# Altium project Phaser.PrjPCB (part 6 of 9)

## Sheet FPGA_GTP.SchDoc: Phaser
size 420 x 297 mm; EDA_Number: ARTIQ; Projet: ARTIQ/SINARA; Author: G.Kasprowicz; CompanyName: WUT ISE; DrawnBy: G.Kasprowicz; Organization: WUT ISE; Address1: PW ISE; Address2: Nowowiejska 15/19 00-665 Warsaw; Address3: gkasprow@gmail.com; DocumentNumber: 13; Revision: 2; SheetNumber: 13; SheetTotal: 18; ModifiedBy: -; CheckedDate: -; Title2: GTP & SATA; DivGrp: WUT ISE; Designer: G.Kasprowicz; ModifiedDate: -; ProjectName: Sensor Box
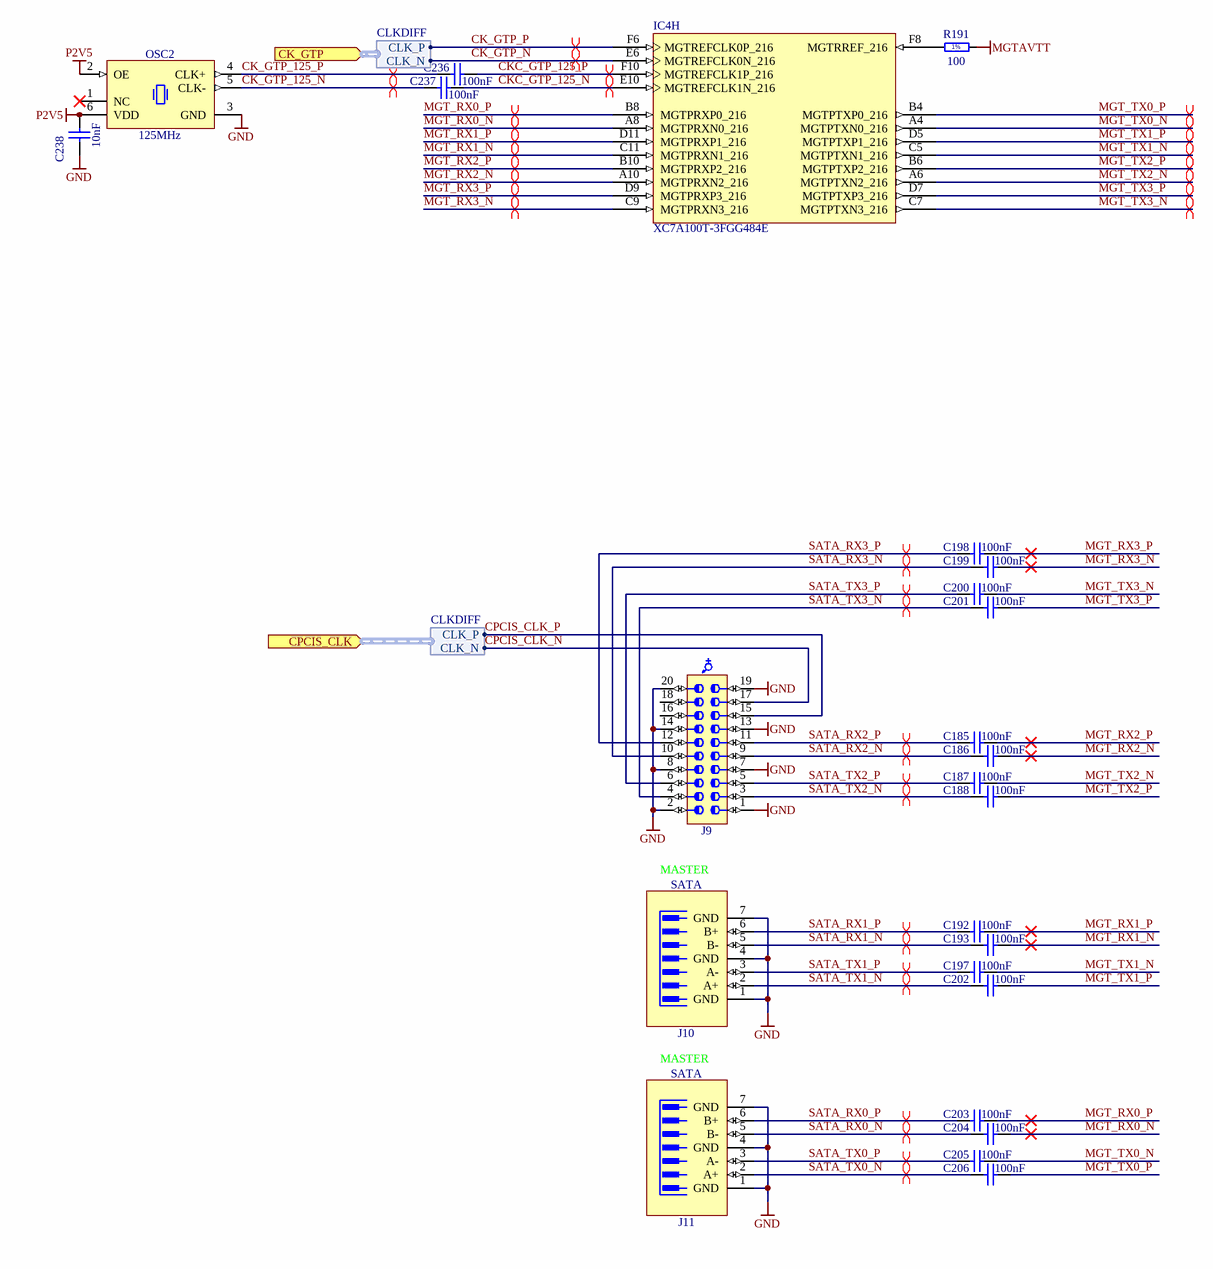
[diagram p10: FPGA_GTP.SchDoc]

### Parts
(Parts that share a designator on the sheet are numbered #1, #2 ... from top to bottom, then left to right.)
C185  100nF  [CAPC0603X33N]
C186  100nF  [CAPC0603X33N]
C187  100nF  [CAPC0603X33N]
C188  100nF  [CAPC0603X33N]
C192  100nF  [CAPC0603X33N]
C193  100nF  [CAPC0603X33N]
C197  100nF  [CAPC0603X33N]
C198  100nF  [CAPC0603X33N]
C199  100nF  [CAPC0603X33N]
C200  100nF  [CAPC0603X33N]
C201  100nF  [CAPC0603X33N]
C202  100nF  [CAPC0603X33N]
C203  100nF  [CAPC0603X33N]
C204  100nF  [CAPC0603X33N]
C205  100nF  [CAPC0603X33N]
C206  100nF  [CAPC0603X33N]
C236  100nF  [CAPC0603X33N]
C237  100nF  [CAPC0603X33N]
C238  10nF  [CAPC1005X55N]
IC4#2  XC7A100T-3FGG484E  [FGG484]  (part H of 10)
J9  (no value)  [SAMTEC_LSS-110-01-L-DV-A]
J10  SATA  [MOLEX_67800-5005]
J11  SATA  [MOLEX_67800-5005]
OSC2  125MHz  [OSC_SILICON-LAB_SI510-6N]
R191  100  [RESC1005X40N]

### Ports
CK_GTP (in, harness CLKDIFF), CPCIS_CLK (in, harness CLKDIFF)

### Harnesses
CLKDIFF: CLK_N, CLK_P

### Nets
GND: C238.1 J9.1 J9.2 J9.7 J9.8 J9.13 J9.14 J9.19 J9.20 J10.1(GND) J10.4(GND) J10.7(GND) J11.1(GND) J11.4(GND) J11.7(GND) OSC2.3(GND)
MGTAVTT: R191.1
P2V5: C238.2 OSC2.2(OE) OSC2.6(VDD)
CK_GTP_125_N: C237.1 OSC2.5(CLK-)
CK_GTP_125_P: C236.1 OSC2.4(CLK+)
CK_GTP_N: IC4#2.E6(MGTREFCLK0N_216) ; port CK_GTP.CLK_N
CK_GTP_P: IC4#2.F6(MGTREFCLK0P_216) ; port CK_GTP.CLK_P
CKC_GTP_125_N: C237.2 IC4#2.E10(MGTREFCLK1N_216)
CKC_GTP_125_P: C236.2 IC4#2.F10(MGTREFCLK1P_216)
CPCIS_CLK_N: J9.17 ; port CPCIS_CLK.CLK_N
CPCIS_CLK_P: J9.15 ; port CPCIS_CLK.CLK_P
MGT_RX0_N: C204.2 IC4#2.A8(MGTPRXN0_216)
MGT_RX0_P: C203.2 IC4#2.B8(MGTPRXP0_216)
MGT_RX1_N: C193.2 IC4#2.C11(MGTPRXN1_216)
MGT_RX1_P: C192.2 IC4#2.D11(MGTPRXP1_216)
MGT_RX2_N: C186.2 IC4#2.A10(MGTPRXN2_216)
MGT_RX2_P: C185.2 IC4#2.B10(MGTPRXP2_216)
MGT_RX3_N: C199.2 IC4#2.C9(MGTPRXN3_216)
MGT_RX3_P: C198.2 IC4#2.D9(MGTPRXP3_216)
MGT_TX0_N: C205.2 IC4#2.A4(MGTPTXN0_216)
MGT_TX0_P: C206.2 IC4#2.B4(MGTPTXP0_216)
MGT_TX1_N: C197.2 IC4#2.C5(MGTPTXN1_216)
MGT_TX1_P: C202.2 IC4#2.D5(MGTPTXP1_216)
MGT_TX2_N: C187.2 IC4#2.A6(MGTPTXN2_216)
MGT_TX2_P: C188.2 IC4#2.B6(MGTPTXP2_216)
MGT_TX3_N: C200.2 IC4#2.C7(MGTPTXN3_216)
MGT_TX3_P: C201.2 IC4#2.D7(MGTPTXP3_216)
SATA_RX0_N: C204.1 J11.5(B-)
SATA_RX0_P: C203.1 J11.6(B+)
SATA_RX1_N: C193.1 J10.5(B-)
SATA_RX1_P: C192.1 J10.6(B+)
SATA_RX2_N: C186.1 J9.9
SATA_RX2_P: C185.1 J9.11
SATA_RX3_N: C199.1 J9.10
SATA_RX3_P: C198.1 J9.12
SATA_TX0_N: C206.1 J11.2(A+)
SATA_TX0_P: C205.1 J11.3(A-)
SATA_TX1_N: C202.1 J10.2(A+)
SATA_TX1_P: C197.1 J10.3(A-)
SATA_TX2_N: C188.1 J9.3
SATA_TX2_P: C187.1 J9.5
SATA_TX3_N: C201.1 J9.4
SATA_TX3_P: C200.1 J9.6
NetIC4#2_F8: IC4#2.F8(MGTRREF_216) R191.2

Not connected (* = marked no-connect by the designer): J9 16 18; OSC2 1(NC)*

### Layout directives
differential pair: CK_GTP_N, CK_GTP_P
differential pair; net class Diff_100Ohm; differential pair class Diff_100Ohm: CK_GTP_125_N, CK_GTP_125_P, CKC_GTP_125_N, CKC_GTP_125_P, MGT_RX0_N, MGT_RX0_P, MGT_RX1_N, MGT_RX1_P, MGT_RX2_N, MGT_RX2_P, MGT_RX3_N, MGT_RX3_P, MGT_TX0_N, MGT_TX0_P, MGT_TX1_N, MGT_TX1_P, MGT_TX2_N, MGT_TX2_P, MGT_TX3_N, MGT_TX3_P, SATA_RX0_N, SATA_RX0_P, SATA_RX1_N, SATA_RX1_P, SATA_RX2_N, SATA_RX2_P, SATA_RX3_N, SATA_RX3_P, SATA_TX0_N, SATA_TX0_P, SATA_TX1_N, SATA_TX1_P, SATA_TX2_N, SATA_TX2_P, SATA_TX3_N, SATA_TX3_P

### Notes on the sheet
- MASTER
- Project/Equipment
- Document
- Designer
- Drawn by
- Check.by
- Copyright WUT ISE 2018.
  This documentation describes Open Hardware and is licensed under the CERN OHL v.1.1. You may redistribute and modify this documentation under the terms of the CERN OHL v.1.1. (http://ohwr.org/CERNOHL). This documentation is distributed WITHOUT ANY EXPRESS OR IMPLIED WARRANTY, INCLUDING OF MERCHANTABILITY, SATISFACTORY QUALITY AND FITNESS FOR A PARTICULAR PURPOSE. Please see the CERN OHL v.1.1 for applicable conditions.
- Contact
- File
- Last Mod.
- Print Date
- Sheet
- Size
- A3
- of
- Rev
- (in symbol R0402_100R_1%_0.0625W_100PPM) 1%

### Library data of the parts
C185-C188 C192 C193 C197-C206 C236 C237 = CC0201_100NF_6.3V_10%_X5R: Non-polarised capacitor; Part Description: SMD Multilayer Chip Ceramic Capacitor; Manufacturer: GENERIC; Manufacturer1 Part Number: 02016D104KAT2A; Voltage: 6.3V; TC: X5R; Tolerance: ±10%; Part Number: CC0201_100NF_6.3V_10%_X5R; Component Kind: Standard; Component Type: Standard; Pin Count: 2; Value: 100nF; Status: Not Recommended; Manufacturer Part Number: CC0201_100NF_6.3V_10%_X5R; Case: 0201; Mounted: Yes; Socket: No; SMD: Yes; Sense: No; Manufacturer1 Example: AVX; Manufacturer1 ComponentHeight: 0.33mm; HelpURL: \\cern.ch\dfs\Applications\Altium\Datasheets\CC0201_X5R_AVX.pdf; Author: CERN DEM JLC; CreateDate: 2007-12-03; LatestRevisionDate: 2007-12-03
  C185-C188 C192 C193 C197-C206: ClassName: SATA
C238 = CC0402_10NF_16V_10%_X7R: Non-polarised capacitor; Part Description: SMD Multilayer Chip Ceramic Capacitor; Manufacturer: GENERIC; Manufacturer1 Part Number: 223878715636; Voltage: 16V; TC: X7R; Tolerance: ±10%; Part Number: CC0402_10NF_16V_10%_X7R; Component Kind: Standard; Component Type: Standard; Pin Count: 2; Value: 10nF; Status: Not Recommended; Manufacturer Part Number: CC0402_10NF_16V_10%_X7R; Case: 0402; Mounted: Yes; Socket: No; SMD: Yes; Sense: No; Manufacturer1 Example: PHYCOMP; Manufacturer1 ComponentHeight: 0.55mm; HelpURL: \\cern.ch\dfs\Applications\Altium\Datasheets\CC0402_X7R_PHYCOMP.pdf; Author: CERN DEM JLC; CreateDate: 03.12.2007; LatestRevisionDate: 03.12.2007
IC4#2 = CMP-0364-00028-3: Artix-7 FPGA, 285 User I/Os, 4 GTP, 484-Ball BGA, Speed Grade 3, Extended Grade, Pb-Free; Manufacturer: Xilinx; Max User I/O: 300; Clock Mgmt Tiles (CMTs): 6; Logic Cells: 101440; Block RAM Blocks (36Kb): 135; Block RAM Blocks (18Kb): 270; Speed Grade: -3; CLBs (Slices): 15850; Block RAM Blocks (Max Kb): 4860; DSP48E1 Slices: 240; RoHS: Pb-Free; ComponentLink3URL: http://www.xilinx.com/support/documentation/data_sheets/ds181_Artix_7_Data_Sheet.pdf; NexusDeviceID: XC7A100T-3FGG484E; DatasheetVersion: v1.12; Mounting Technology: Surface Mount; PackageDescription: Wire-Bond Fine-Pitch BGA, Body 23 x 23 mm, 1.0 mm Pitch; PackageReference: FGG484; ComponentLink2Description: Package Specification; Code_JEDEC: MS-034-AAJ-1; ComponentLink2URL: http://www.xilinx.com/support/documentation/user_guides/ug475_7Series_Pkg_Pinout.pdf; ComponentLink3Description: DC and Switching Characteristics; Generic Part Number: XC7A100T; ComponentLink4Description: Package File; ComponentLink4URL: http://www.xilinx.com/support/packagefiles/a7packages/xc7a100tfgg484pkg.txt; ComponentLink1URL: http://www.xilinx.com/support/documentation/data_sheets/ds180_7Series_Overview.pdf; PartNumber: XC7A100T-3FGG484E; ComponentLink5URL: http://www.xilinx.com/support/documentation/user_guides/ug475_7Series_Pkg_Pinout.pdf; PackageVersion: Rev 1.8; ComponentLink5Description: Packaging and Pinout; ComponentLink1Description: Datasheet; CLBs (Max Distributed RAM Kb): 1188
J9 = SAMTEC_LSS-110-01-L-DV-A: Connector 20 Hermaphroditic; Part Description: 20 Contacts, Pitch 0.635mm, Razor Beam LSS Vertical High Speed Hermaphroditic Strip (Lead Style 4.5mm); Manufacturer: SAMTEC; PressFit: No; Part Number: SAMTEC_LSS-110-01-L-DV-A; Component Kind: Standard; Component Type: Standard; Pin Count: 20; Mounted: Yes; Socket: No; Sense: No; SMD: Yes; Status: None; Manufacturer Part Number: LSS-110-01-L-DV-A; ComponentHeight: 4.57mm; HelpURL: \\cern.ch\dfs\Applications\Altium\Datasheets\SAMTEC_LSS-110-01-L-DV-A.pdf; Author: CERN DEM MR; CreateDate: 07.03.2016; LatestRevisionDate: 07.03.2016
J10 J11 = MOLEX_67800-5005: 7 Pin SATA Receptacle; Part Description: 1.27mm Pitch, 7 Contacts, Serial ATA High Speed Header, Straight with Locking Latch; Manufacturer: MOLEX; PressFit: No; Part Number: MOLEX_67800-5005; Component Kind: Standard; Component Type: Standard; Pin Count: 7; Family: SATA; Mounted: Yes; Socket: No; SMD: Yes; Sense: No; Status: None; Manufacturer Part Number: 67800-5005; ComponentHeight: 8.4mm; HelpURL: \\cern.ch\dfs\Applications\Altium\Datasheets\MOLEX_67800-5005.pdf; Author: CERN DEM MR; CreateDate: 01.12.2016; LatestRevisionDate: 01.12.2016; ClassName: SATA
OSC2 = OSC_125MHZ_SILICON-LAB_510FBA125M000AAG: Crystal Oscillator 6 pins, Si510 (LVDS/LVPECL/HCSL/Dual CMOS); Part Description: 2.5V ±25ppm LVDS Crystal Oscillator (XO), Si510 Series; Manufacturer: SILICON LABS; PressFit: No; Bonding: No; Part Number: OSC_125MHZ_SILICON-LAB_510FBA125M000AAG; Component Kind: Standard; Component Type: Standard; PackageDescription: Oscillator Si510 Series, 6 pins, 5x7mm; Value: 125MHz; Manufacturer Part Number: 510FBA125M000AAG; Pin Count: 6; Mounted: Yes; Socket: No; SMD: Yes; Sense: No; ComponentHeight: 1.8mm; HelpURL: \\cern.ch\dfs\Applications\Altium\Datasheets\OSC_SILICON-LAB_SI510.pdf; Author: CERN DEM JMW; CreateDate: 2015-08-10; LatestRevisionDate: 2015-08-10
R191 = R0402_100R_1%_0.0625W_100PPM: Resistor - 1%; Part Description: General Purpose Thick Film Chip Resistor; Manufacturer: GENERIC; Manufacturer1 Part Number: 232270671001L; TC: ±100ppm/°C; PressFit: No; Part Number: R0402_100R_1%_0.0625W_100PPM; Component Kind: Standard; Component Type: Standard; Pin Count: 2; Value: 100; Status: Not Recommended; Power: 0.0625W; Tolerance: ±1%; Manufacturer Part Number: R0402_100R_1%_0.0625W_100PPM; Case: 0402; Mounted: Yes; Sense: No; Socket: No; SMD: Yes; Manufacturer1 Example: YAGEO PHYCOMP; Manufacturer1 ComponentHeight: 0.4mm; HelpURL: \\cern.ch\dfs\Applications\Altium\Datasheets\R0402_Phycomp_RC0402.pdf; Author: CERN DEM JLC; CreateDate: 03.12.2007; LatestRevisionDate: 17.10.2012; ClassName: Artix

## Sheet FPGA_SDRAM.SchDoc: Phaser
size 420 x 297 mm; EDA_Number: ARTIQ; Projet: ARTIQ/SINARA; Author: G.Kasprowicz; CompanyName: WUT ISE; DrawnBy: G.Kasprowicz; Organization: WUT ISE; Address1: PW ISE; Address2: Nowowiejska 15/19 00-665 Warsaw; Address3: gkasprow@gmail.com; DocumentNumber: 14; Revision: 2; SheetNumber: 14; SheetTotal: 18; ModifiedBy: -; CheckedDate: -; Title2: FPGA SDRAM; DivGrp: WUT ISE; Designer: G.Kasprowicz; ModifiedDate: -; ProjectName: Sensor Box
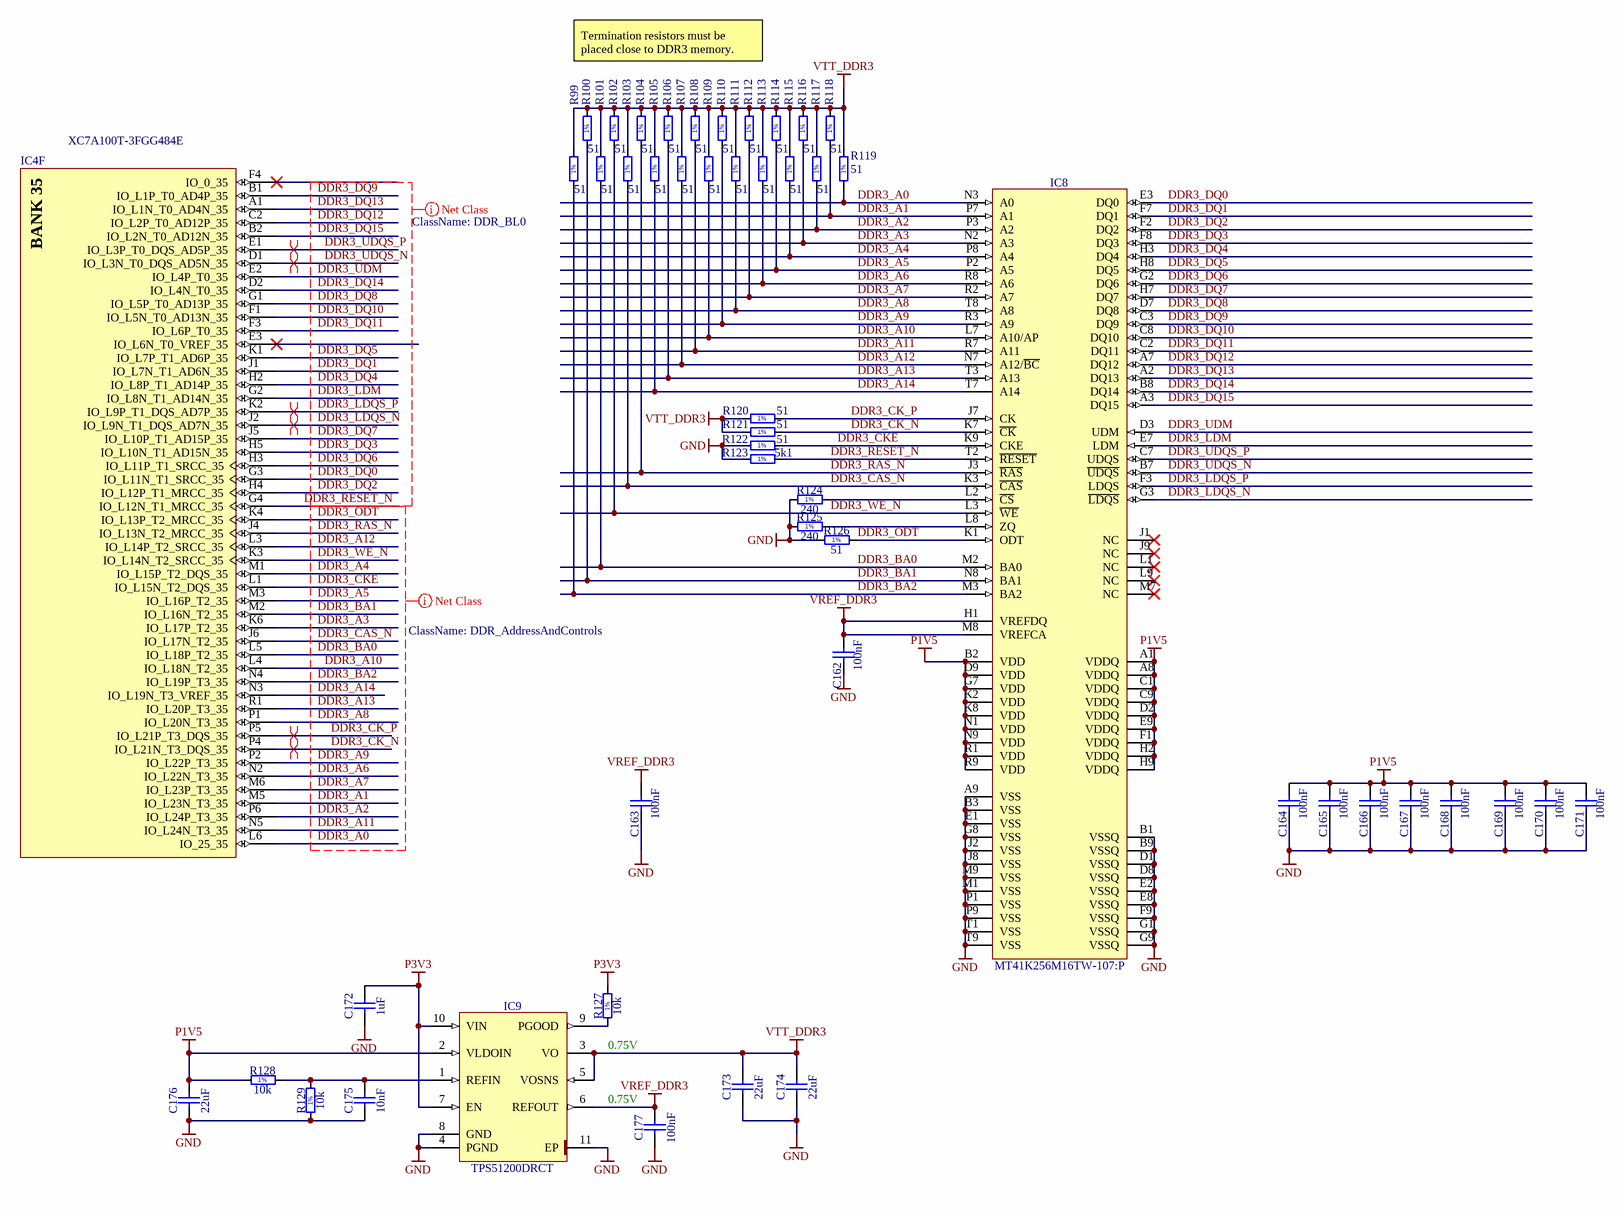
[diagram p11: FPGA_SDRAM.SchDoc]

### Parts
(Parts that share a designator on the sheet are numbered #1, #2 ... from top to bottom, then left to right.)
C162  100nF  [CAPC0603X33N]
C163  100nF  [CAPC0603X33N]
C164  100nF  [CAPC0603X33N]
C165  100nF  [CAPC0603X33N]
C166  100nF  [CAPC0603X33N]
C167  100nF  [CAPC0603X33N]
C168  100nF  [CAPC0603X33N]
C169  100nF  [CAPC0603X33N]
C170  100nF  [CAPC0603X33N]
C171  100nF  [CAPC0603X33N]
C172  1uF  [CAPC1005X55N]
C173  22uF  [CAPC1709X100N]
C174  22uF  [CAPC1709X100N]
C175  10nF  [CAPC1005X55N]
C176  22uF  [CAPC1709X100N]
C177  100nF  [CAPC0603X33N]
IC4#1  XC7A100T-3FGG484E  [FGG484]  (part F of 10)
IC8  MT41K256M16TW-107:P  [BGA96C80P9X16_800X1400X120]
IC9  TPS51200DRCT  [TEXAS_DRC (S-PVSON-N10)]
R99  51  [RESC1005X40N]
R100  51  [RESC1005X40N]
R101  51  [RESC1005X40N]
R102  51  [RESC1005X40N]
R103  51  [RESC1005X40N]
R104  51  [RESC1005X40N]
R105  51  [RESC1005X40N]
R106  51  [RESC1005X40N]
R107  51  [RESC1005X40N]
R108  51  [RESC1005X40N]
R109  51  [RESC1005X40N]
R110  51  [RESC1005X40N]
R111  51  [RESC1005X40N]
R112  51  [RESC1005X40N]
R113  51  [RESC1005X40N]
R114  51  [RESC1005X40N]
R115  51  [RESC1005X40N]
R116  51  [RESC1005X40N]
R117  51  [RESC1005X40N]
R118  51  [RESC1005X40N]
R119  51  [RESC1005X40N]
R120  51  [RESC1005X40N]
R121  51  [RESC1005X40N]
R122  51  [RESC1005X40N]
R123  5k1  [RESC1005X40N]
R124  240  [RESC1005X40N]
R125  240  [RESC1005X40N]
R126  51  [RESC1005X40N]
R127  10k  [RESC1005X40N]
R128  10k  [RESC1005X40N]
R129  10k  [RESC1005X40N]

### Nets
GND: C162.1 C163.1 C164.1 C165.1 C166.1 C167.1 C168.1 C169.1 C170.1 C171.1 C172.1 C173.1 C174.1 C175.1 C176.1 C177.1 IC8.A9(VSS) IC8.B1(VSSQ) IC8.B3(VSS) IC8.B9(VSSQ) IC8.D1(VSSQ) IC8.D8(VSSQ) IC8.E1(VSS) IC8.E2(VSSQ) IC8.E8(VSSQ) IC8.F9(VSSQ) IC8.G1(VSSQ) IC8.G8(VSS) IC8.G9(VSSQ) IC8.J2(VSS) IC8.J8(VSS) IC8.M1(VSS) IC8.M9(VSS) IC8.P1(VSS) IC8.P9(VSS) IC8.T1(VSS) IC8.T9(VSS) IC9.4(PGND) IC9.8(GND) IC9.11(EP) R122.1 R123.1 R124.1 R125.1 R126.1 R129.1
P1V5: C164.2 C165.2 C166.2 C167.2 C168.2 C169.2 C170.2 C171.2 C176.2 IC8.A1(VDDQ) IC8.A8(VDDQ) IC8.B2(VDD) IC8.C1(VDDQ) IC8.C9(VDDQ) IC8.D2(VDDQ) IC8.D9(VDD) IC8.E9(VDDQ) IC8.F1(VDDQ) IC8.G7(VDD) IC8.H2(VDDQ) IC8.H9(VDDQ) IC8.K2(VDD) IC8.K8(VDD) IC8.N1(VDD) IC8.N9(VDD) IC8.R1(VDD) IC8.R9(VDD) IC9.2(VLDOIN) R128.1
P3V3: C172.2 IC9.7(EN) IC9.10(VIN) R127.2
VREF_DDR3: C162.2 C163.2 C177.2 IC8.H1(VREFDQ) IC8.M8(VREFCA) IC9.6(REFOUT)
VTT_DDR3: C173.2 C174.2 IC9.3(VO) IC9.5(VOSNS) R99.2 R100.2 R101.2 R102.2 R103.2 R104.2 R105.2 R106.2 R107.2 R108.2 R109.2 R110.2 R111.2 R112.2 R113.2 R114.2 R115.2 R116.2 R117.2 R118.2 R119.2 R120.1 R121.1
DDR3_A0: IC4#1.L6(IO_25_35) IC8.N3(A0) R119.1
DDR3_A1: IC4#1.M5(IO_L23N_T3_35) IC8.P7(A1) R118.1
DDR3_A2: IC4#1.P6(IO_L24P_T3_35) IC8.P3(A2) R117.1
DDR3_A3: IC4#1.K6(IO_L17P_T2_35) IC8.N2(A3) R116.1
DDR3_A4: IC4#1.M1(IO_L15P_T2_DQS_35) IC8.P8(A4) R115.1
DDR3_A5: IC4#1.M3(IO_L16P_T2_35) IC8.P2(A5) R114.1
DDR3_A6: IC4#1.N2(IO_L22N_T3_35) IC8.R8(A6) R113.1
DDR3_A7: IC4#1.M6(IO_L23P_T3_35) IC8.R2(A7) R112.1
DDR3_A8: IC4#1.P1(IO_L20N_T3_35) IC8.T8(A8) R111.1
DDR3_A9: IC4#1.P2(IO_L22P_T3_35) IC8.R3(A9) R110.1
DDR3_A10: IC4#1.L4(IO_L18N_T2_35) IC8.L7(A10/AP) R109.1
DDR3_A11: IC4#1.N5(IO_L24N_T3_35) IC8.R7(A11) R108.1
DDR3_A12: IC4#1.L3(IO_L14P_T2_SRCC_35) IC8.N7(A12/~{BC}) R107.1
DDR3_A13: IC4#1.R1(IO_L20P_T3_35) IC8.T3(A13) R106.1
DDR3_A14: IC4#1.N3(IO_L19N_T3_VREF_35) IC8.T7(A14) R105.1
DDR3_BA0: IC4#1.L5(IO_L18P_T2_35) IC8.M2(BA0) R101.1
DDR3_BA1: IC4#1.M2(IO_L16N_T2_35) IC8.N8(BA1) R100.1
DDR3_BA2: IC4#1.N4(IO_L19P_T3_35) IC8.M3(BA2) R99.1
DDR3_CAS_N: IC4#1.J6(IO_L17N_T2_35) IC8.K3(~{CAS}) R103.1
DDR3_CK_N: IC4#1.P4(IO_L21N_T3_DQS_35) IC8.K7(~{CK}) R121.2
DDR3_CK_P: IC4#1.P5(IO_L21P_T3_DQS_35) IC8.J7(CK) R120.2
DDR3_CKE: IC4#1.L1(IO_L15N_T2_DQS_35) IC8.K9(CKE) R122.2
DDR3_DQ0: IC4#1.G3(IO_L11N_T1_SRCC_35) IC8.E3(DQ0)
DDR3_DQ1: IC4#1.J1(IO_L7N_T1_AD6N_35) IC8.F7(DQ1)
DDR3_DQ2: IC4#1.H4(IO_L12P_T1_MRCC_35) IC8.F2(DQ2)
DDR3_DQ3: IC4#1.H5(IO_L10N_T1_AD15N_35) IC8.F8(DQ3)
DDR3_DQ4: IC4#1.H2(IO_L8P_T1_AD14P_35) IC8.H3(DQ4)
DDR3_DQ5: IC4#1.K1(IO_L7P_T1_AD6P_35) IC8.H8(DQ5)
DDR3_DQ6: IC4#1.H3(IO_L11P_T1_SRCC_35) IC8.G2(DQ6)
DDR3_DQ7: IC4#1.J5(IO_L10P_T1_AD15P_35) IC8.H7(DQ7)
DDR3_DQ8: IC4#1.G1(IO_L5P_T0_AD13P_35) IC8.D7(DQ8)
DDR3_DQ9: IC4#1.B1(IO_L1P_T0_AD4P_35) IC8.C3(DQ9)
DDR3_DQ10: IC4#1.F1(IO_L5N_T0_AD13N_35) IC8.C8(DQ10)
DDR3_DQ11: IC4#1.F3(IO_L6P_T0_35) IC8.C2(DQ11)
DDR3_DQ12: IC4#1.C2(IO_L2P_T0_AD12P_35) IC8.A7(DQ12)
DDR3_DQ13: IC4#1.A1(IO_L1N_T0_AD4N_35) IC8.A2(DQ13)
DDR3_DQ14: IC4#1.D2(IO_L4N_T0_35) IC8.B8(DQ14)
DDR3_DQ15: IC4#1.B2(IO_L2N_T0_AD12N_35) IC8.A3(DQ15)
DDR3_LDM: IC4#1.G2(IO_L8N_T1_AD14N_35) IC8.E7(LDM)
DDR3_LDQS_N: IC4#1.J2(IO_L9N_T1_DQS_AD7N_35) IC8.G3(~{LDQS})
DDR3_LDQS_P: IC4#1.K2(IO_L9P_T1_DQS_AD7P_35) IC8.F3(LDQS)
DDR3_ODT: IC4#1.K4(IO_L13P_T2_MRCC_35) IC8.K1(ODT) R126.2
DDR3_RAS_N: IC4#1.J4(IO_L13N_T2_MRCC_35) IC8.J3(~{RAS}) R104.1
DDR3_RESET_N: IC4#1.G4(IO_L12N_T1_MRCC_35) IC8.T2(~{RESET}) R123.2
DDR3_UDM: IC4#1.E2(IO_L4P_T0_35) IC8.D3(UDM)
DDR3_UDQS_N: IC4#1.D1(IO_L3N_T0_DQS_AD5N_35) IC8.B7(~{UDQS})
DDR3_UDQS_P: IC4#1.E1(IO_L3P_T0_DQS_AD5P_35) IC8.C7(UDQS)
DDR3_WE_N: IC4#1.K3(IO_L14N_T2_SRCC_35) IC8.L3(~{WE}) R102.1
NetC175_2: C175.2 IC9.1(REFIN) R128.2 R129.2
NetIC8_L2: IC8.L2(~{CS}) R124.2
NetIC8_L8: IC8.L8(ZQ) R125.2
NetIC9_9: IC9.9(PGOOD) R127.1

Not connected (* = marked no-connect by the designer): IC4#1 E3(IO_L6N_T0_VREF_35)* F4(IO_0_35)*; IC8 J1(NC)* J9(NC)* L1(NC)* L9(NC)* M7(NC)*

### Layout directives
differential pair: DDR3_CK_N, DDR3_CK_P, DDR3_LDQS_N, DDR3_LDQS_P, DDR3_UDQS_N, DDR3_UDQS_P
net class DDR_AddressAndControls; net class 50Ohm: DDR3_A0, DDR3_A1, DDR3_A2, DDR3_A3, DDR3_A4, DDR3_A5, DDR3_A6, DDR3_A7, DDR3_A8, DDR3_A9, DDR3_A10, DDR3_A11, DDR3_A12, DDR3_A13, DDR3_A14, DDR3_BA0, DDR3_BA1, DDR3_BA2, DDR3_CAS_N, DDR3_CK_N, DDR3_CK_P, DDR3_CKE, DDR3_ODT, DDR3_RAS_N, DDR3_WE_N
net class DDR_BL0; net class 50Ohm: DDR3_DQ0, DDR3_DQ1, DDR3_DQ2, DDR3_DQ3, DDR3_DQ4, DDR3_DQ5, DDR3_DQ6, DDR3_DQ7, DDR3_DQ8, DDR3_DQ9, DDR3_DQ10, DDR3_DQ11, DDR3_DQ12, DDR3_DQ13, DDR3_DQ14, DDR3_DQ15, DDR3_LDM, DDR3_LDQS_N, DDR3_LDQS_P, DDR3_UDM, DDR3_UDQS_N, DDR3_UDQS_P

### Notes on the sheet
- Termination resistors must be placed close to DDR3 memory.
- (near R127) 0.75V
- (near C177) 0.75V
- Project/Equipment
- Document
- Designer
- Drawn by
- Check.by
- Copyright WUT ISE 2018.
  This documentation describes Open Hardware and is licensed under the CERN OHL v.1.1. You may redistribute and modify this documentation under the terms of the CERN OHL v.1.1. (http://ohwr.org/CERNOHL). This documentation is distributed WITHOUT ANY EXPRESS OR IMPLIED WARRANTY, INCLUDING OF MERCHANTABILITY, SATISFACTORY QUALITY AND FITNESS FOR A PARTICULAR PURPOSE. Please see the CERN OHL v.1.1 for applicable conditions.
- Contact
- File
- Last Mod.
- Print Date
- Sheet
- Size
- A3
- of
- Rev
- (in symbol CMP-0364-00028-3, part F) BANK 35
- (in symbol R0402_5K1_1%_0.0625W_100PPM) 1%
- (in symbol R0402_10K_1%_0.0625W_100PPM) 1%
- (in symbol R0402_51R_1%_0.0625W_100PPM) 1%
- (in symbol R0402_240R_1%_0.0625W_100PPM) 1%

### Library data of the parts
C162-C171 C177 = CC0201_100NF_6.3V_10%_X5R: as C185-C188 on sheet FPGA_GTP; Part Number: CC0201_100NF_6.3V_10%_X5R; Component Kind: Standard; Component Type: Standard; Pin Count: 2; Value: 100nF; Status: Not Recommended; Manufacturer Part Number: CC0201_100NF_6.3V_10%_X5R; Case: 0201; Mounted: Yes; Socket: No; SMD: Yes; Sense: No; Manufacturer1 Example: AVX; Manufacturer1 ComponentHeight: 0.33mm; HelpURL: \\cern.ch\dfs\Applications\Altium\Datasheets\CC0201_X5R_AVX.pdf; Author: CERN DEM JLC
  C162-C171: CreateDate: 2007-12-03; LatestRevisionDate: 2007-12-03
  C177: CreateDate: 03.12.2007; LatestRevisionDate: 03.12.2007
C172 = CC0402_1UF_16V_10%_X5R: Non-polarised capacitor; Part Description: SMD Multilayer Chip Ceramic Capacitor; Manufacturer: GENERIC; Manufacturer1 Part Number: C1005X5R1C105KT; Voltage: 16V; TC: X5R; Tolerance: ±10%; Part Number: CC0402_1UF_16V_10%_X5R; Component Kind: Standard; Component Type: Standard; Pin Count: 2; Value: 1uF; Status: Preferred; Manufacturer Part Number: CC0402_1UF_16V_10%_X5R; Case: 0402; Mounted: Yes; Socket: No; SMD: Yes; Manufacturer1 Example: TDK; Manufacturer1 ComponentHeight: 0.55mm; HelpURL: \\cern.ch\dfs\Applications\Altium\Datasheets\CC0402_X5R_TDK_C.pdf; Author: CERN DEM JLC; CreateDate: 25.10.2012; LatestRevisionDate: 25.10.2012; Sense: No
C173 C174 C176 = CC0603_22UF_6.3V_20%_X5R: Non-polarised capacitor; Part Description: SMD Multilayer Chip Ceramic Capacitor; Manufacturer: GENERIC; Manufacturer1 Part Number: C1608X5R0J226M080AC; Voltage: 6.3V; TC: X5R; Tolerance: ±20%; Part Number: CC0603_22UF_6.3V_20%_X5R; Component Kind: Standard; Component Type: Standard; Pin Count: 2; Value: 22uF; Status: None; Manufacturer Part Number: CC0603_22UF_6.3V_20%_X5R; Case: 0603; Mounted: Yes; Socket: No; SMD: Yes; Manufacturer1 Example: TDK; Manufacturer1 ComponentHeight: 1mm; HelpURL: \\cern.ch\dfs\Applications\Altium\Datasheets\CC0603_X5R_TDK_C.pdf; Author: CERN DEM JLC; CreateDate: 16.12.2013; LatestRevisionDate: 13.09.2016; Sense: No
C175 = CC0402_10NF_16V_10%_X7R: as C238 on sheet FPGA_GTP; Part Number: CC0402_10NF_16V_10%_X7R; Component Kind: Standard; Component Type: Standard; Pin Count: 2; Value: 10nF; Status: Not Recommended; Manufacturer Part Number: CC0402_10NF_16V_10%_X7R; Case: 0402; Mounted: Yes; Socket: No; SMD: Yes; Manufacturer1 Example: PHYCOMP; Manufacturer1 ComponentHeight: 0.55mm; HelpURL: \\cern.ch\dfs\Applications\Altium\Datasheets\CC0402_X7R_PHYCOMP.pdf; Author: CERN DEM JLC; CreateDate: 03.12.2007; LatestRevisionDate: 03.12.2007; Sense: No
IC4#1 = CMP-0364-00028-3: as IC4#2 on sheet FPGA_GTP; RoHS: Pb-Free; ComponentLink3URL: http://www.xilinx.com/support/documentation/data_sheets/ds181_Artix_7_Data_Sheet.pdf; NexusDeviceID: XC7A100T-3FGG484E; DatasheetVersion: v1.12; Mounting Technology: Surface Mount; PackageDescription: Wire-Bond Fine-Pitch BGA, Body 23 x 23 mm, 1.0 mm Pitch; PackageReference: FGG484; ComponentLink2Description: Package Specification; Code_JEDEC: MS-034-AAJ-1; ComponentLink2URL: http://www.xilinx.com/support/documentation/user_guides/ug475_7Series_Pkg_Pinout.pdf; ComponentLink3Description: DC and Switching Characteristics; Generic Part Number: XC7A100T; ComponentLink4Description: Package File; ComponentLink4URL: http://www.xilinx.com/support/packagefiles/a7packages/xc7a100tfgg484pkg.txt; ComponentLink1URL: http://www.xilinx.com/support/documentation/data_sheets/ds180_7Series_Overview.pdf; PartNumber: XC7A100T-3FGG484E; ComponentLink5URL: http://www.xilinx.com/support/documentation/user_guides/ug475_7Series_Pkg_Pinout.pdf; PackageVersion: Rev 1.8; ComponentLink5Description: Packaging and Pinout; ComponentLink1Description: Datasheet; CLBs (Max Distributed RAM Kb): 1188
IC8 = MT41K256M16TW-107:P: 32 Meg x 16 x 8 Banks DDR3L SDRAM; Part Description: +1.5V, 4Gb (32Meg x 16 x 8 banks) DDR3L SDRAM; Manufacturer: MICRON TECHNOLOGY; PressFit: No; Bonding: No; Part Number: MT41K256M16TW-107:P; Component Kind: Standard; Component Type: Standard; Device: MT41K256M16TW-107:P; PackageDescription: BGA 0.8mm, Pitch, Square 96 Pin, 9 Columns x 16 Rows, Body 14mm X 8mm X 1.2mm H; Manufacturer Part Number: MT41K256M16TW-107:P; Pin Count: 96; Case: BGA96; Mounted: Yes; Socket: No; SMD: Yes; Sense: No; ComponentHeight: 1.2mm; HelpURL: \\cern.ch\dfs\Applications\Altium\Datasheets\MT41K256M16TW-107-P.pdf; Author: CERN DEM MR; CreateDate: 2015-12-14; LatestRevisionDate: 2015-12-14
IC9 = TPS51200DRCT: Sink/Source DDR Termination Regulator; Part Description: 3.3V Sink/Source DDR Termination Regulator; Manufacturer: TEXAS INSTRUMENTS; PressFit: No; Bonding: No; Part Number: TPS51200DRCT; Component Kind: Standard; Component Type: Standard; Device: TPS51200DRCT; PackageDescription: SON, 0.50mm Pitch, 10-pin, 3.00mm W  X 3.00mm L X 1.00mm Height, (w/thermal tab 1.75 X 2.50 mm); Manufacturer Part Number: TPS51200DRCT; Pin Count: 11; Case: SON10; Mounted: Yes; Socket: No; SMD: Yes; Sense: No; ComponentHeight: 1mm; HelpURL: \\cern.ch\dfs\Applications\Altium\Datasheets\TPS51200DRCT.pdf; Author: CERN DEM JLC; CreateDate: 03.02.2010; LatestRevisionDate: 06.11.2013
R99-R121 = R0402_51R_1%_0.0625W_100PPM: Resistor - 1%; Part Description: General Purpose Thick Film Chip Resistor; Manufacturer: GENERIC; Manufacturer1 Part Number: 232270675109; TC: ±100ppm/°C; Table: Resistors SMD; Part Number: R0402_51R_1%_0.0625W_100PPM; Component Kind: Standard; Component Type: Standard; Pin Count: 2; Value: 51; Status: Not recommended; Power: 0.0625W; Tolerance: ±1%; Manufacturer Part Number: R0402_51R_1%_0.0625W_100PPM; Mounted: Yes; Socket: No; SMD: Yes; Manufacturer1 Example: PHYCOMP; Manufacturer1 ComponentHeight: 0.4mm; HelpURL: \\cern.ch\dfs\Applications\Altium\Datasheets\R0402_Phycomp_RC0402.pdf; Author: CERN DEM JLC; CreateDate: 03/12/2007; LatestRevisionDate: 13/03/2008
  R99-R118 R120 R121: Case: 0402
R122 R126 = R0402_51R_1%_0.0625W_100PPM: Resistor - 1%; Part Description: General Purpose Thick Film Chip Resistor; Manufacturer: GENERIC; Manufacturer1 Part Number: 232270675109L; TC: ±100ppm/°C; PressFit: No; Part Number: R0402_51R_1%_0.0625W_100PPM; Component Kind: Standard; Component Type: Standard; Pin Count: 2; Value: 51; Status: Not Recommended; Power: 0.0625W; Tolerance: ±1%; Manufacturer Part Number: R0402_51R_1%_0.0625W_100PPM; Case: 0402; Mounted: Yes; Sense: No; Socket: No; SMD: Yes; Manufacturer1 Example: YAGEO PHYCOMP; Manufacturer1 ComponentHeight: 0.4mm; HelpURL: \\cern.ch\dfs\Applications\Altium\Datasheets\R0402_Phycomp_RC0402.pdf; Author: CERN DEM JLC; CreateDate: 2007-12-03; LatestRevisionDate: 2012-10-17
R123 = R0402_5K1_1%_0.0625W_100PPM: Resistor - 1%; Part Description: General Purpose Thick Film Chip Resistor; Manufacturer: GENERIC; Manufacturer1 Part Number: 232270675102L; TC: ±100ppm/°C; PressFit: No; Part Number: R0402_5K1_1%_0.0625W_100PPM; Component Kind: Standard; Component Type: Standard; Pin Count: 2; Value: 5k1; Status: Not Recommended; Power: 0.0625W; Tolerance: ±1%; Manufacturer Part Number: R0402_5K1_1%_0.0625W_100PPM; Case: 0402; Mounted: Yes; Sense: No; Socket: No; SMD: Yes; Manufacturer1 Example: YAGEO PHYCOMP; Manufacturer1 ComponentHeight: 0.4mm; HelpURL: \\cern.ch\dfs\Applications\Altium\Datasheets\R0402_Phycomp_RC0402.pdf; Author: CERN DEM JLC; CreateDate: 03.12.2007; LatestRevisionDate: 17.10.2012
R124 R125 = R0402_240R_1%_0.0625W_100PPM: Resistor - 1%; Part Description: General Purpose Thick Film Chip Resistor; Manufacturer: GENERIC; Manufacturer1 Part Number: 232270672401L; TC: ±100ppm/°C; PressFit: No; Part Number: R0402_240R_1%_0.0625W_100PPM; Component Kind: Standard; Component Type: Standard; Pin Count: 2; Value: 240; Status: Not Recommended; Power: 0.0625W; Tolerance: ±1%; Manufacturer Part Number: R0402_240R_1%_0.0625W_100PPM; Case: 0402; Mounted: Yes; Sense: No; Socket: No; SMD: Yes; Manufacturer1 Example: YAGEO PHYCOMP; Manufacturer1 ComponentHeight: 0.4mm; HelpURL: \\cern.ch\dfs\Applications\Altium\Datasheets\R0402_Phycomp_RC0402.pdf; Author: CERN DEM JLC; CreateDate: 03.12.2007; LatestRevisionDate: 17.10.2012
R127-R129 = R0402_10K_1%_0.0625W_100PPM: Resistor - 1%; Part Description: General Purpose Thick Film Chip Resistor; Manufacturer: GENERIC; Manufacturer1 Part Number: 232270671003L; TC: ±100ppm/°C; PressFit: No; Part Number: R0402_10K_1%_0.0625W_100PPM; Component Kind: Standard; Component Type: Standard; Pin Count: 2; Value: 10k; Status: Not Recommended; Power: 0.0625W; Tolerance: ±1%; Manufacturer Part Number: R0402_10K_1%_0.0625W_100PPM; Case: 0402; Mounted: Yes; Socket: No; SMD: Yes; Manufacturer1 Example: YAGEO PHYCOMP; Manufacturer1 ComponentHeight: 0.4mm; HelpURL: \\cern.ch\dfs\Applications\Altium\Datasheets\R0402_Phycomp_RC0402.pdf; Author: CERN DEM JLC; CreateDate: 03.12.2007; LatestRevisionDate: 17.10.2012; Sense: No

## Sheet FPGA_ADC_DAC.SchDoc: Phaser
size 420 x 297 mm; EDA_Number: ARTIQ; Projet: ARTIQ/SINARA; Author: G.Kasprowicz; CompanyName: WUT ISE; DrawnBy: G.Kasprowicz; Organization: WUT ISE; Address1: PW ISE; Address2: Nowowiejska 15/19 00-665 Warsaw; Address3: gkasprow@gmail.com; DocumentNumber: 8; Revision: 2; SheetNumber: 8; SheetTotal: 18; ModifiedBy: -; CheckedDate: -; Title2: FPGA DAC; DivGrp: WUT ISE; Designer: G.Kasprowicz; ModifiedDate: -; ProjectName: Sensor Box
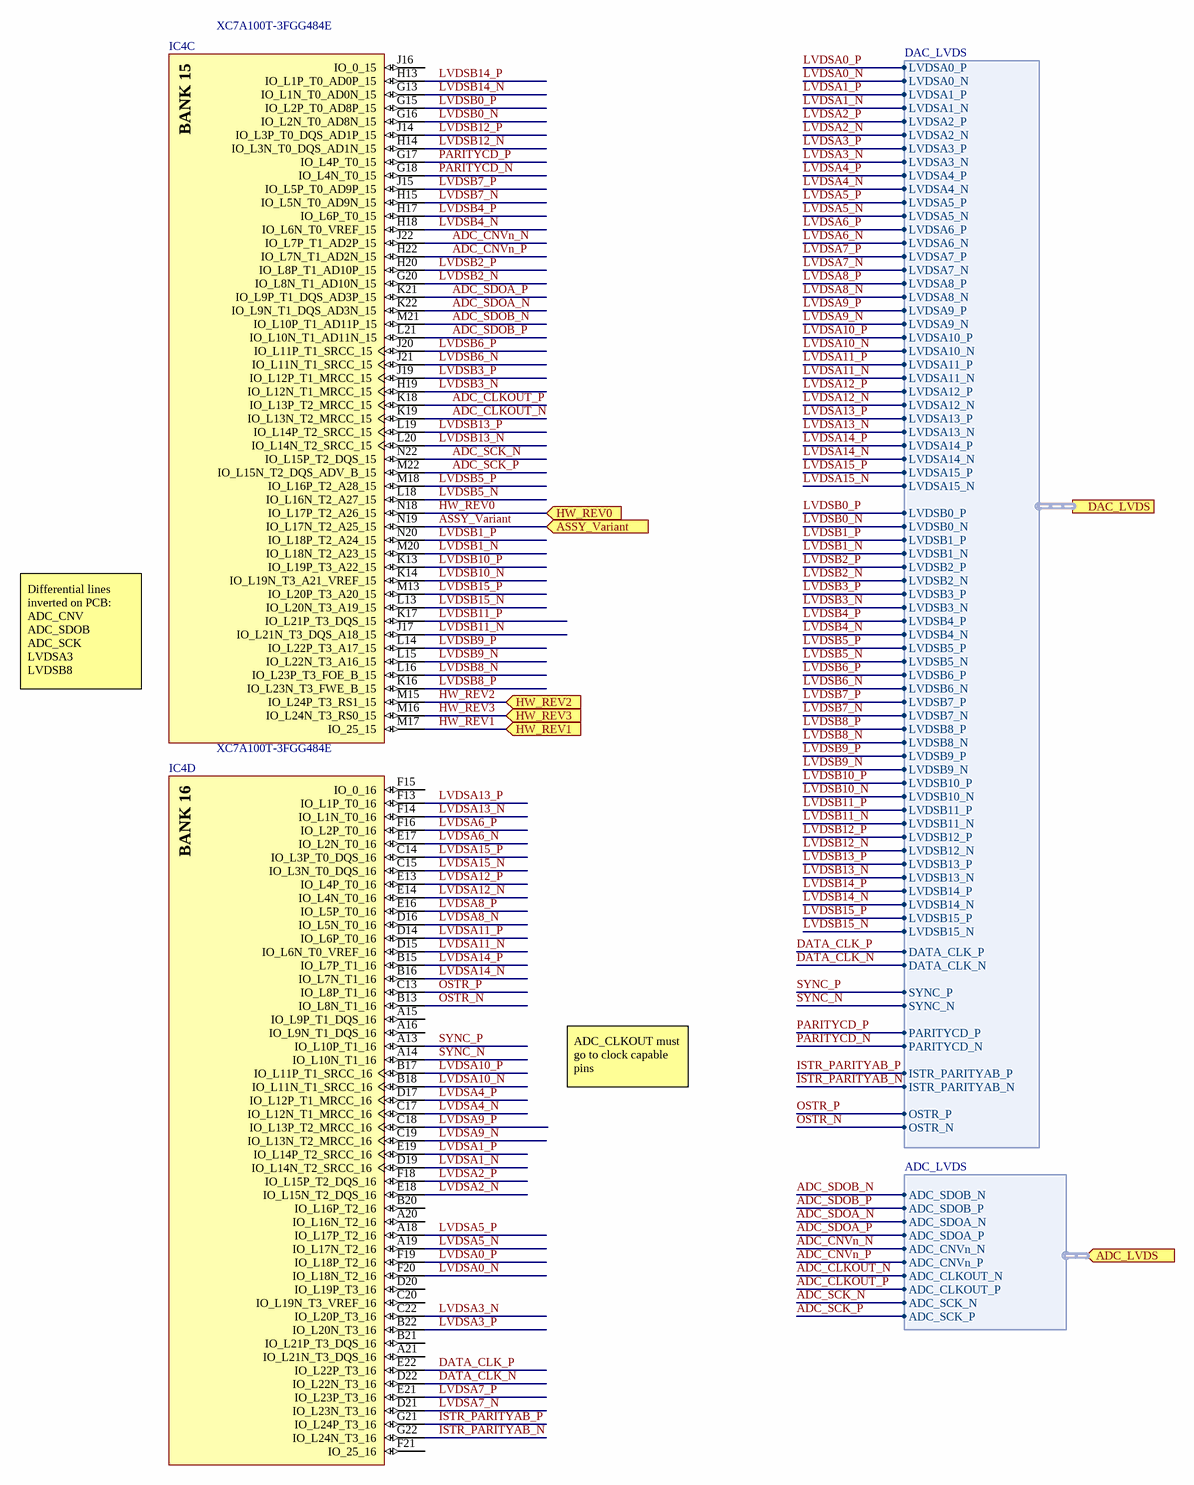
[diagram p12: FPGA_ADC_DAC.SchDoc]

### Parts
(Parts that share a designator on the sheet are numbered #1, #2 ... from top to bottom, then left to right.)
IC4#1  XC7A100T-3FGG484E  [FGG484]  (parts C,D of 10)

### Ports
ADC_LVDS (in, harness ADC_LVDS), ASSY_Variant (in), DAC_LVDS (harness DAC_LVDS), HW_REV0 (in), HW_REV1 (in), HW_REV2 (in), HW_REV3 (in)

### Harnesses
DAC_LVDS: LVDSA0_P, LVDSA0_N, LVDSA1_P, LVDSA1_N, LVDSA2_P, LVDSA2_N, LVDSA3_P, LVDSA3_N, LVDSA4_P, LVDSA4_N, LVDSA5_P, LVDSA5_N, LVDSA6_P, LVDSA6_N, LVDSA7_P, LVDSA7_N, LVDSA8_P, LVDSA8_N, LVDSA9_P, LVDSA9_N, LVDSA10_P, LVDSA10_N, LVDSA11_P, LVDSA11_N, LVDSA12_P, LVDSA12_N, LVDSA13_P, LVDSA13_N, LVDSA14_P, LVDSA14_N, LVDSA15_P, LVDSA15_N, LVDSB0_P, LVDSB0_N, LVDSB1_P, LVDSB1_N, LVDSB2_P, LVDSB2_N, LVDSB3_P, LVDSB3_N, LVDSB4_P, LVDSB4_N, LVDSB5_P, LVDSB5_N, LVDSB6_P, LVDSB6_N, LVDSB7_P, LVDSB7_N, LVDSB8_P, LVDSB8_N, LVDSB9_P, LVDSB9_N, LVDSB10_P, LVDSB10_N, LVDSB11_P, LVDSB11_N, LVDSB12_P, LVDSB12_N, LVDSB13_P, LVDSB13_N, LVDSB14_P, LVDSB14_N, LVDSB15_P, LVDSB15_N, DATA_CLK_P, DATA_CLK_N, SYNC_P, SYNC_N, PARITYCD_P, PARITYCD_N, ISTR_PARITYAB_P, ISTR_PARITYAB_N, OSTR_P, OSTR_N
ADC_LVDS: ADC_SDOB_N, ADC_SDOB_P, ADC_SDOA_N, ADC_SDOA_P, ADC_CNVn_N, ADC_CNVn_P, ADC_CLKOUT_N, ADC_CLKOUT_P, ADC_SCK_N, ADC_SCK_P

### Nets
ADC_CLKOUT_N: IC4#1.K19(IO_L13N_T2_MRCC_15) ; port ADC_LVDS.ADC_CLKOUT_N
ADC_CLKOUT_P: IC4#1.K18(IO_L13P_T2_MRCC_15) ; port ADC_LVDS.ADC_CLKOUT_P
ADC_CNVn_N: IC4#1.J22(IO_L7P_T1_AD2P_15) ; port ADC_LVDS.ADC_CNVn_N
ADC_CNVn_P: IC4#1.H22(IO_L7N_T1_AD2N_15) ; port ADC_LVDS.ADC_CNVn_P
ADC_SCK_N: IC4#1.N22(IO_L15P_T2_DQS_15) ; port ADC_LVDS.ADC_SCK_N
ADC_SCK_P: IC4#1.M22(IO_L15N_T2_DQS_ADV_B_15) ; port ADC_LVDS.ADC_SCK_P
ADC_SDOA_N: IC4#1.K22(IO_L9N_T1_DQS_AD3N_15) ; port ADC_LVDS.ADC_SDOA_N
ADC_SDOA_P: IC4#1.K21(IO_L9P_T1_DQS_AD3P_15) ; port ADC_LVDS.ADC_SDOA_P
ADC_SDOB_N: IC4#1.M21(IO_L10P_T1_AD11P_15) ; port ADC_LVDS.ADC_SDOB_N
ADC_SDOB_P: IC4#1.L21(IO_L10N_T1_AD11N_15) ; port ADC_LVDS.ADC_SDOB_P
ASSY_Variant: IC4#1.N19(IO_L17N_T2_A25_15) ; port ASSY_Variant
DATA_CLK_N: IC4#1.D22(IO_L22N_T3_16) ; port DAC_LVDS.DATA_CLK_N
DATA_CLK_P: IC4#1.E22(IO_L22P_T3_16) ; port DAC_LVDS.DATA_CLK_P
HW_REV0: IC4#1.N18(IO_L17P_T2_A26_15) ; port HW_REV0
HW_REV1: IC4#1.M17(IO_25_15) ; port HW_REV1
HW_REV2: IC4#1.M15(IO_L24P_T3_RS1_15) ; port HW_REV2
HW_REV3: IC4#1.M16(IO_L24N_T3_RS0_15) ; port HW_REV3
ISTR_PARITYAB_N: IC4#1.G22(IO_L24N_T3_16) ; port DAC_LVDS.ISTR_PARITYAB_N
ISTR_PARITYAB_P: IC4#1.G21(IO_L24P_T3_16) ; port DAC_LVDS.ISTR_PARITYAB_P
LVDSA0_N: IC4#1.F20(IO_L18N_T2_16) ; port DAC_LVDS.LVDSA0_N
LVDSA0_P: IC4#1.F19(IO_L18P_T2_16) ; port DAC_LVDS.LVDSA0_P
LVDSA1_N: IC4#1.D19(IO_L14N_T2_SRCC_16) ; port DAC_LVDS.LVDSA1_N
LVDSA1_P: IC4#1.E19(IO_L14P_T2_SRCC_16) ; port DAC_LVDS.LVDSA1_P
LVDSA2_N: IC4#1.E18(IO_L15N_T2_DQS_16) ; port DAC_LVDS.LVDSA2_N
LVDSA2_P: IC4#1.F18(IO_L15P_T2_DQS_16) ; port DAC_LVDS.LVDSA2_P
LVDSA3_N: IC4#1.C22(IO_L20P_T3_16) ; port DAC_LVDS.LVDSA3_N
LVDSA3_P: IC4#1.B22(IO_L20N_T3_16) ; port DAC_LVDS.LVDSA3_P
LVDSA4_N: IC4#1.C17(IO_L12N_T1_MRCC_16) ; port DAC_LVDS.LVDSA4_N
LVDSA4_P: IC4#1.D17(IO_L12P_T1_MRCC_16) ; port DAC_LVDS.LVDSA4_P
LVDSA5_N: IC4#1.A19(IO_L17N_T2_16) ; port DAC_LVDS.LVDSA5_N
LVDSA5_P: IC4#1.A18(IO_L17P_T2_16) ; port DAC_LVDS.LVDSA5_P
LVDSA6_N: IC4#1.E17(IO_L2N_T0_16) ; port DAC_LVDS.LVDSA6_N
LVDSA6_P: IC4#1.F16(IO_L2P_T0_16) ; port DAC_LVDS.LVDSA6_P
LVDSA7_N: IC4#1.D21(IO_L23N_T3_16) ; port DAC_LVDS.LVDSA7_N
LVDSA7_P: IC4#1.E21(IO_L23P_T3_16) ; port DAC_LVDS.LVDSA7_P
LVDSA8_N: IC4#1.D16(IO_L5N_T0_16) ; port DAC_LVDS.LVDSA8_N
LVDSA8_P: IC4#1.E16(IO_L5P_T0_16) ; port DAC_LVDS.LVDSA8_P
LVDSA9_N: IC4#1.C19(IO_L13N_T2_MRCC_16) ; port DAC_LVDS.LVDSA9_N
LVDSA9_P: IC4#1.C18(IO_L13P_T2_MRCC_16) ; port DAC_LVDS.LVDSA9_P
LVDSA10_N: IC4#1.B18(IO_L11N_T1_SRCC_16) ; port DAC_LVDS.LVDSA10_N
LVDSA10_P: IC4#1.B17(IO_L11P_T1_SRCC_16) ; port DAC_LVDS.LVDSA10_P
LVDSA11_N: IC4#1.D15(IO_L6N_T0_VREF_16) ; port DAC_LVDS.LVDSA11_N
LVDSA11_P: IC4#1.D14(IO_L6P_T0_16) ; port DAC_LVDS.LVDSA11_P
LVDSA12_N: IC4#1.E14(IO_L4N_T0_16) ; port DAC_LVDS.LVDSA12_N
LVDSA12_P: IC4#1.E13(IO_L4P_T0_16) ; port DAC_LVDS.LVDSA12_P
LVDSA13_N: IC4#1.F14(IO_L1N_T0_16) ; port DAC_LVDS.LVDSA13_N
LVDSA13_P: IC4#1.F13(IO_L1P_T0_16) ; port DAC_LVDS.LVDSA13_P
LVDSA14_N: IC4#1.B16(IO_L7N_T1_16) ; port DAC_LVDS.LVDSA14_N
LVDSA14_P: IC4#1.B15(IO_L7P_T1_16) ; port DAC_LVDS.LVDSA14_P
LVDSA15_N: IC4#1.C15(IO_L3N_T0_DQS_16) ; port DAC_LVDS.LVDSA15_N
LVDSA15_P: IC4#1.C14(IO_L3P_T0_DQS_16) ; port DAC_LVDS.LVDSA15_P
LVDSB0_N: IC4#1.G16(IO_L2N_T0_AD8N_15) ; port DAC_LVDS.LVDSB0_N
LVDSB0_P: IC4#1.G15(IO_L2P_T0_AD8P_15) ; port DAC_LVDS.LVDSB0_P
LVDSB1_N: IC4#1.M20(IO_L18N_T2_A23_15) ; port DAC_LVDS.LVDSB1_N
LVDSB1_P: IC4#1.N20(IO_L18P_T2_A24_15) ; port DAC_LVDS.LVDSB1_P
LVDSB2_N: IC4#1.G20(IO_L8N_T1_AD10N_15) ; port DAC_LVDS.LVDSB2_N
LVDSB2_P: IC4#1.H20(IO_L8P_T1_AD10P_15) ; port DAC_LVDS.LVDSB2_P
LVDSB3_N: IC4#1.H19(IO_L12N_T1_MRCC_15) ; port DAC_LVDS.LVDSB3_N
LVDSB3_P: IC4#1.J19(IO_L12P_T1_MRCC_15) ; port DAC_LVDS.LVDSB3_P
LVDSB4_N: IC4#1.H18(IO_L6N_T0_VREF_15) ; port DAC_LVDS.LVDSB4_N
LVDSB4_P: IC4#1.H17(IO_L6P_T0_15) ; port DAC_LVDS.LVDSB4_P
LVDSB5_N: IC4#1.L18(IO_L16N_T2_A27_15) ; port DAC_LVDS.LVDSB5_N
LVDSB5_P: IC4#1.M18(IO_L16P_T2_A28_15) ; port DAC_LVDS.LVDSB5_P
LVDSB6_N: IC4#1.J21(IO_L11N_T1_SRCC_15) ; port DAC_LVDS.LVDSB6_N
LVDSB6_P: IC4#1.J20(IO_L11P_T1_SRCC_15) ; port DAC_LVDS.LVDSB6_P
LVDSB7_N: IC4#1.H15(IO_L5N_T0_AD9N_15) ; port DAC_LVDS.LVDSB7_N
LVDSB7_P: IC4#1.J15(IO_L5P_T0_AD9P_15) ; port DAC_LVDS.LVDSB7_P
LVDSB8_N: IC4#1.L16(IO_L23P_T3_FOE_B_15) ; port DAC_LVDS.LVDSB8_N
LVDSB8_P: IC4#1.K16(IO_L23N_T3_FWE_B_15) ; port DAC_LVDS.LVDSB8_P
LVDSB9_N: IC4#1.L15(IO_L22N_T3_A16_15) ; port DAC_LVDS.LVDSB9_N
LVDSB9_P: IC4#1.L14(IO_L22P_T3_A17_15) ; port DAC_LVDS.LVDSB9_P
LVDSB10_N: IC4#1.K14(IO_L19N_T3_A21_VREF_15) ; port DAC_LVDS.LVDSB10_N
LVDSB10_P: IC4#1.K13(IO_L19P_T3_A22_15) ; port DAC_LVDS.LVDSB10_P
LVDSB11_N: IC4#1.J17(IO_L21N_T3_DQS_A18_15) ; port DAC_LVDS.LVDSB11_N
LVDSB11_P: IC4#1.K17(IO_L21P_T3_DQS_15) ; port DAC_LVDS.LVDSB11_P
LVDSB12_N: IC4#1.H14(IO_L3N_T0_DQS_AD1N_15) ; port DAC_LVDS.LVDSB12_N
LVDSB12_P: IC4#1.J14(IO_L3P_T0_DQS_AD1P_15) ; port DAC_LVDS.LVDSB12_P
LVDSB13_N: IC4#1.L20(IO_L14N_T2_SRCC_15) ; port DAC_LVDS.LVDSB13_N
LVDSB13_P: IC4#1.L19(IO_L14P_T2_SRCC_15) ; port DAC_LVDS.LVDSB13_P
LVDSB14_N: IC4#1.G13(IO_L1N_T0_AD0N_15) ; port DAC_LVDS.LVDSB14_N
LVDSB14_P: IC4#1.H13(IO_L1P_T0_AD0P_15) ; port DAC_LVDS.LVDSB14_P
LVDSB15_N: IC4#1.L13(IO_L20N_T3_A19_15) ; port DAC_LVDS.LVDSB15_N
LVDSB15_P: IC4#1.M13(IO_L20P_T3_A20_15) ; port DAC_LVDS.LVDSB15_P
OSTR_N: IC4#1.B13(IO_L8N_T1_16) ; port DAC_LVDS.OSTR_N
OSTR_P: IC4#1.C13(IO_L8P_T1_16) ; port DAC_LVDS.OSTR_P
PARITYCD_N: IC4#1.G18(IO_L4N_T0_15) ; port DAC_LVDS.PARITYCD_N
PARITYCD_P: IC4#1.G17(IO_L4P_T0_15) ; port DAC_LVDS.PARITYCD_P
SYNC_N: IC4#1.A14(IO_L10N_T1_16) ; port DAC_LVDS.SYNC_N
SYNC_P: IC4#1.A13(IO_L10P_T1_16) ; port DAC_LVDS.SYNC_P

Not connected (* = marked no-connect by the designer): IC4#1 A15(IO_L9P_T1_DQS_16) A16(IO_L9N_T1_DQS_16) A20(IO_L16N_T2_16) A21(IO_L21N_T3_DQS_16) B20(IO_L16P_T2_16) B21(IO_L21P_T3_DQS_16) C20(IO_L19N_T3_VREF_16) D20(IO_L19P_T3_16) F15(IO_0_16) F21(IO_25_16) J16(IO_0_15)

### Notes on the sheet
- Differential lines inverted on PCB:
  ADC_CNV
  ADC_SDOB
  ADC_SCK
  LVDSA3
  LVDSB8
- ADC_CLKOUT must go to clock capable pins
- Project/Equipment
- Document
- Designer
- Drawn by
- Check.by
- Copyright WUT ISE 2018.
  This documentation describes Open Hardware and is licensed under the CERN OHL v.1.1. You may redistribute and modify this documentation under the terms of the CERN OHL v.1.1. (http://ohwr.org/CERNOHL). This documentation is distributed WITHOUT ANY EXPRESS OR IMPLIED WARRANTY, INCLUDING OF MERCHANTABILITY, SATISFACTORY QUALITY AND FITNESS FOR A PARTICULAR PURPOSE. Please see the CERN OHL v.1.1 for applicable conditions.
- Contact
- File
- Last Mod.
- Print Date
- Sheet
- Size
- A3
- of
- Rev
- (in symbol CMP-0364-00028-3, part C) BANK 15
- (in symbol CMP-0364-00028-3, part D) BANK 16

### Library data of the parts
IC4#1 = CMP-0364-00028-3: as IC4#2 on sheet FPGA_GTP; RoHS: Pb-Free; ComponentLink3URL: http://www.xilinx.com/support/documentation/data_sheets/ds181_Artix_7_Data_Sheet.pdf; NexusDeviceID: XC7A100T-3FGG484E; DatasheetVersion: v1.12; Mounting Technology: Surface Mount; PackageDescription: Wire-Bond Fine-Pitch BGA, Body 23 x 23 mm, 1.0 mm Pitch; PackageReference: FGG484; ComponentLink2Description: Package Specification; Code_JEDEC: MS-034-AAJ-1; ComponentLink2URL: http://www.xilinx.com/support/documentation/user_guides/ug475_7Series_Pkg_Pinout.pdf; ComponentLink3Description: DC and Switching Characteristics; Generic Part Number: XC7A100T; ComponentLink4Description: Package File; ComponentLink4URL: http://www.xilinx.com/support/packagefiles/a7packages/xc7a100tfgg484pkg.txt; ComponentLink1URL: http://www.xilinx.com/support/documentation/data_sheets/ds180_7Series_Overview.pdf; PartNumber: XC7A100T-3FGG484E; ComponentLink5URL: http://www.xilinx.com/support/documentation/user_guides/ug475_7Series_Pkg_Pinout.pdf; PackageVersion: Rev 1.8; ComponentLink5Description: Packaging and Pinout; ComponentLink1Description: Datasheet; CLBs (Max Distributed RAM Kb): 1188

## Sheet CFG_FLASH_Update.SchDoc: Phaser
size 420 x 297 mm; Author: G.Kasprowicz; CompanyName: WUT ISE; DrawnBy: G.Kasprowicz; Organization: WUT ISE; Address1: PW ISE; Address2: Nowowiejska 15/19 00-665 Warsaw; Address3: gkasprow@gmail.com; DocumentNumber: 11; Revision: 2; SheetNumber: 11; SheetTotal: 18; ModifiedBy: -; CheckedDate: -; Title2: CFG FLASH & update interface; DivGrp: WUT ISE; Designer: G.Kasprowicz; ModifiedDate: -; ProjectName: Sensor Box
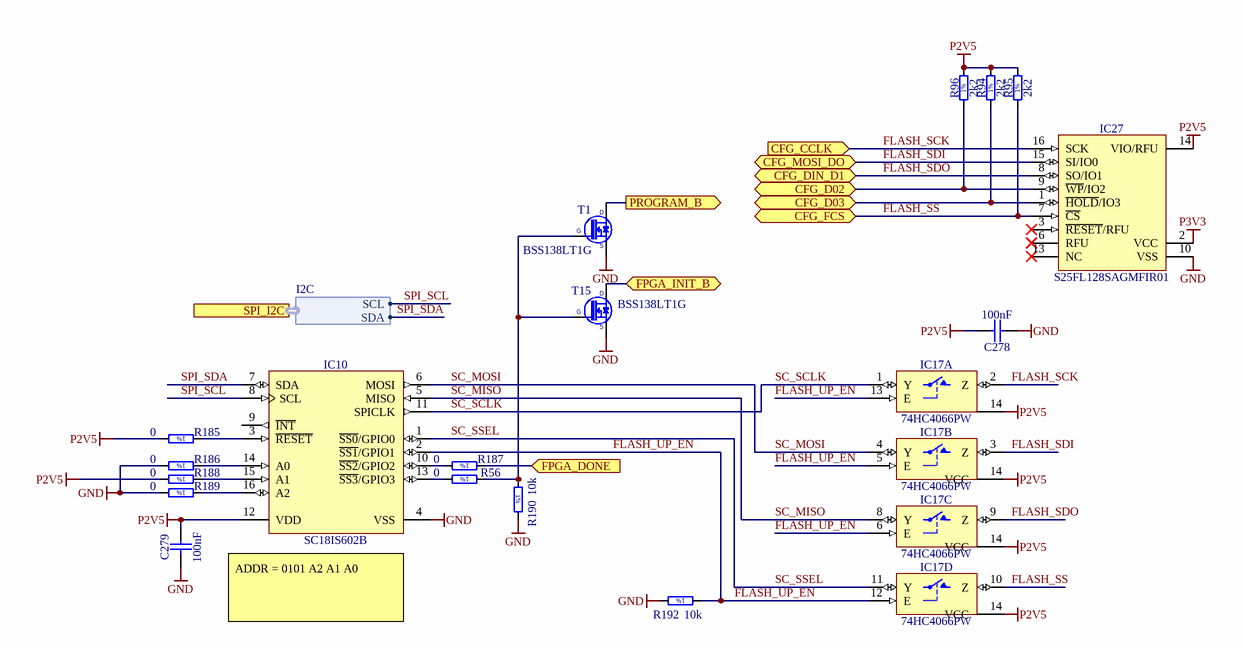
[diagram p13: CFG_FLASH_Update.SchDoc]

### Parts
C278  100nF  [CAPC1005X55N]
C279  100nF  [CAPC1005X55N]
IC10  SC18IS602B  [SOP65P640X110-16N]
IC17  74HC4066PW  [SOP65P640X110-14N]  (parts A,B,C,D of 4)
IC27  S25FL128SAGMFIR01  [SOIC127P1030X265-16N]
R56  0  [RESC1608X55N]
R94  2k2  [RESC1005X40N]
R95  2k2  [RESC1005X40N]
R96  2k2  [RESC1005X40N]
R185  0  [RESC1608X55N]
R186  0  [RESC1608X55N]
R187  0  [RESC1608X55N]
R188  0  [RESC1608X55N]
R189  0  [RESC1608X55N]
R190  10k  [RESC1005X40N]
R192  10k  [RESC1005X40N]
T1  BSS138LT1G  [SOT95P240X110-3N]
T15  BSS138LT1G  [SOT95P240X110-3N]

### Ports
CFG_CCLK (in), CFG_D02 (bidir), CFG_D03 (bidir), CFG_DIN_D1 (bidir), CFG_FCS (bidir), CFG_MOSI_DO (bidir), FPGA_DONE (in), FPGA_INIT_B (bidir), PROGRAM_B (out), SPI_I2C (harness I2C)

### Harnesses
I2C: SDA, SCL

### Nets
GND: C278.1 C279.1 IC10.4(VSS) IC17.7(GND) IC27.10(VSS) R186.2 R189.2 R190.2 R192.2 T1.2(S) T15.2(S)
P2V5: C278.2 C279.2 IC10.12(VDD) IC17.14(VCC) IC27.14(VIO/RFU) R94.2 R95.2 R96.2 R185.2 R188.2
P3V3: IC27.2(VCC)
CFG_D02: IC27.9(~{WP}/IO2) R96.1 ; port CFG_D02
CFG_D03: IC27.1(~{HOLD}/IO3) R94.1 ; port CFG_D03
FLASH_SCK: IC17.2(Z) IC27.16(SCK) ; port CFG_CCLK  [project net CFG_CCLK]
FLASH_SDI: IC17.3(Z) IC27.15(SI/IO0) ; port CFG_MOSI_DO  [project net CFG_MOSI]
FLASH_SDO: IC17.9(Z) IC27.8(SO/IO1) ; port CFG_DIN_D1  [project net CFG_DIN]
FLASH_SS: IC17.10(Z) IC27.7(~{CS}) R95.1 ; port CFG_FCS  [project net CFG_FCS]
FLASH_UP_EN: IC10.2(~{SS1}/GPIO1) IC17.5(E) IC17.6(E) IC17.12(E) IC17.13(E) R192.1
FPGA_DONE: R187.1 ; port FPGA_DONE
FPGA_INIT_B: T15.3(D) ; port FPGA_INIT_B
FPGA_PROGRAM_B: T1.3(D) ; port PROGRAM_B
SC_MISO: IC10.5(MISO) IC17.8(Y)
SC_MOSI: IC10.6(MOSI) IC17.4(Y)
SC_SCLK: IC10.11(SPICLK) IC17.1(Y)
SC_SSEL: IC10.1(~{SS0}/GPIO0) IC17.11(Y)
SPI_SCL: IC10.8(SCL) ; port SPI_I2C.SCL  [project net EEM0_I2C_SCL]
SPI_SDA: IC10.7(SDA) ; port SPI_I2C.SDA  [project net EEM0_I2C_SDA]
NetIC10_3: IC10.3(~{RESET}) R185.1
NetIC10_10: IC10.10(~{SS2}/GPIO2) R187.2
NetIC10_13: IC10.13(~{SS3}/GPIO3) R56.2
NetIC10_14: IC10.14(A0) R186.1
NetIC10_15: IC10.15(A1) R188.1
NetIC10_16: IC10.16(A2) R189.1
NetR56_1: R56.1 R190.1 T1.1(G) T15.1(G)

Not connected (* = marked no-connect by the designer): IC10 9(~{INT}); IC27 3(~{RESET}/RFU)* 6(RFU)* 13(NC)*

### Notes on the sheet
- ADDR = 0101 A2 A1 A0
- Project/Equipment
- Document
- Designer
- Drawn by
- Check.by
- Copyright WUT ISE 2018.
  This documentation describes Open Hardware and is licensed under the CERN OHL v.1.1. You may redistribute and modify this documentation under the terms of the CERN OHL v.1.1. (http://ohwr.org/CERNOHL). This documentation is distributed WITHOUT ANY EXPRESS OR IMPLIED WARRANTY, INCLUDING OF MERCHANTABILITY, SATISFACTORY QUALITY AND FITNESS FOR A PARTICULAR PURPOSE. Please see the CERN OHL v.1.1 for applicable conditions.
- Contact
- File
- Last Mod.
- Print Date
- Sheet
- Size
- A3
- of
- Rev
- (in symbol R0402_2K2_1%_0.0625W_100PPM) 1%
- (in symbol R0402_10K_1%_0.0625W_100PPM) 1%
- (in symbol R0603_0R_JUMPER) 1%

### Library data of the parts
C278 C279 = CC0402_100NF_16V_10%_X5R: Non-polarised capacitor; Part Description: SMD Multilayer Chip Ceramic Capacitor; Manufacturer: GENERIC; Manufacturer1 Part Number: GRM155R61C104KA88D; Voltage: 16V; TC: X5R; Tolerance: ±10%; Part Number: CC0402_100NF_16V_10%_X5R; Component Kind: Standard; Component Type: Standard; Pin Count: 2; Value: 100nF; Status: None; Manufacturer Part Number: CC0402_100NF_16V_10%_X5R; Case: 0402; Mounted: Yes; Socket: No; SMD: Yes; Sense: No; Manufacturer1 Example: MURATA; Manufacturer1 ComponentHeight: 0.55mm; HelpURL: \\cern.ch\dfs\Applications\Altium\Datasheets\CC0402_X5R_MURATA_GRM.pdf; Author: CERN DEM JLC; CreateDate: 10.12.2013; LatestRevisionDate: 10.12.2013
IC10 = SC18IS602B: I2C-bus to SPI bridge; Manufacturer: NXP SEMICONDUCTORS; PressFit: No; Bonding: No; Part Number: SC18IS602B; Component Kind: Standard; Component Type: Standard; Device: SC18IS602B; PackageDescription: SOP, 0.65mm pitch; 16 pin, 4.40mm W X 5.00mm L X 1.10mm H body IPC Medium Density; Part Description: I2C-Bus to SPI Bridge; Manufacturer Part Number: SC18IS602B; Pin Count: 16; Case: TSSOP16; Mounted: Yes; Socket: No; SMD: Yes; Sense: No; ComponentHeight: 1.1mm; HelpURL: \\cern.ch\dfs\Applications\Altium\Datasheets\SC18IS602B.pdf; Author: CERN DEM MR; CreateDate: 14/12/2015; LatestRevisionDate: 14/12/2015
IC17 = 74HC4066PW: Part Description: Quad Single-Pole Single-Throw Analog Switch; Manufacturer: NXP SEMICONDUCTORS; PressFit: No; Bonding: No; Table: Standard Logic; Part Number: 74HC4066PW; Component Kind: Standard; Component Type: Standard; Device: 74HC4066PW; PackageDescription: SOP, 14-Leads, Body 4.4x5mm (max), Pitch 0.65mm, IPC Medium Density; Manufacturer Part Number: 74HC4066PW; Pin Count: 14; Case: TSSOP14; Mounted: Yes; Socket: No; SMD: Yes; ComponentHeight: 1.1mm; Author: CERN DEM JLC; HelpURL: \\cern.ch\dfs\Applications\Altium\Datasheets\74HC4066PW.pdf; CreateDate: 2014-11-19; LatestRevisionDate: 2014-11-19
IC27 = S25FL128SAGMFIR01: 128Mbit, MirrorBit® Flash Non-Volatile Memory CMOS 3.0 Volt Core with Versatile I/O Serial Peripheral Interface with Multi-I/O; Part Description: 128Mbit, 133MHz, MirrorBit® Flash Non-Volatile Memory CMOS 3V Core with Versatile I/O Serial Peripheral Interface with Multi-I/O; Manufacturer: SPANSION; PressFit: No; Bonding: No; Part Number: S25FL128SAGMFIR01; Component Kind: Standard; Component Type: Standard; Device: S25FL128SAGMFIR01; PackageDescription: SOIC 16, Pitch 1.27mm - Body 7.5x10.3mm, IPC Medium Density; Manufacturer Part Number: S25FL128SAGMFIR01; Pin Count: 11; Case: SOIC16; Mounted: Yes; Socket: No; SMD: Yes; Sense: No; ComponentHeight: 2.65mm; HelpURL: \\cern.ch\dfs\Applications\Altium\Datasheets\S25FL128SAGMFIR01.pdf; Author: CERN DEM JLC; CreateDate: 2014-07-10; LatestRevisionDate: 2014-07-10
R56 R185-R189 = R0603_0R_JUMPER: Resistor - 1%; Part Description: 1A (0.05R Max DC Resistance) Zero Ohm Jumper; Manufacturer: GENERIC; Manufacturer1 Part Number: NRC06Z0; Table: Resistors SMD; Part Number: R0603_0R_JUMPER; Component Kind: Standard; Component Type: Standard; Pin Count: 2; Value: 0; Status: Preferred; Manufacturer Part Number: R0603_0R_JUMPER; Case: 0603; Mounted: Yes; Socket: No; SMD: Yes; Manufacturer1 Example: NIC COMPONENT; Manufacturer1 ComponentHeight: 0.55mm; HelpURL: \\cern.ch\dfs\Applications\Altium\Datasheets\R0603_NIC_NRC.pdf; Author: CERN DEM JLC; CreateDate: 2007-12-03; LatestRevisionDate: 2008-03-13
R94-R96 = R0402_2K2_1%_0.0625W_100PPM: Resistor - 1%; Part Description: General Purpose Thick Film Chip Resistor; Manufacturer: GENERIC; Manufacturer1 Part Number: 232270672202L; TC: ±100ppm/°C; PressFit: No; Part Number: R0402_2K2_1%_0.0625W_100PPM; Component Kind: Standard; Component Type: Standard; Pin Count: 2; Value: 2k2; Status: Not Recommended; Power: 0.0625W; Tolerance: ±1%; Manufacturer Part Number: R0402_2K2_1%_0.0625W_100PPM; Case: 0402; Mounted: Yes; Sense: No; Socket: No; SMD: Yes; Manufacturer1 Example: YAGEO PHYCOMP; Manufacturer1 ComponentHeight: 0.4mm; HelpURL: \\cern.ch\dfs\Applications\Altium\Datasheets\R0402_Phycomp_RC0402.pdf; Author: CERN DEM JLC; CreateDate: 03.12.2007; LatestRevisionDate: 17.10.2012; ClassName: Artix
R190 R192 = R0402_10K_1%_0.0625W_100PPM: Resistor - 1%; Part Description: General Purpose Thick Film Chip Resistor; Manufacturer: GENERIC; Manufacturer1 Part Number: 232270671003L; TC: ±100ppm/°C; Table: Resistors SMD; Part Number: R0402_10K_1%_0.0625W_100PPM; Component Kind: Standard; Component Type: Standard; Pin Count: 2; Value: 10k; Status: Not recommended; Power: 0.0625W; Tolerance: ±1%; Manufacturer Part Number: R0402_10K_1%_0.0625W_100PPM; Case: 0402; Mounted: Yes; Socket: No; SMD: Yes; Manufacturer1 Example: YAGEO PHYCOMP; Manufacturer1 ComponentHeight: 0.4mm; HelpURL: \\cern.ch\dfs\Applications\Altium\Datasheets\R0402_Phycomp_RC0402.pdf; Author: CERN DEM JLC; CreateDate: 2007-12-03; LatestRevisionDate: 2012-10-17
T1 T15 = BSS138LT1G: N-CHANNEL MOSFET WITH DIODE; Part Description: 50V 200mA N-Channel Enhancement Mode Field-Effect Transistor; Manufacturer: ON SEMICONDUCTOR; PressFit: No; Bonding: No; Part Number: BSS138LT1G; Component Kind: Standard; Component Type: Standard; Device: BSS138LT1G; PackageDescription: SOT23 3-Leads, Pitch 0.95mm - Body 1.4x3mm, IPC Medium Density; Manufacturer Part Number: BSS138LT1G; Pin Count: 3; Case: SOT23-3; Mounted: Yes; Socket: No; SMD: Yes; Sense: No; ComponentHeight: 1.11mm; HelpURL: \\cern.ch\dfs\Applications\Altium\Datasheets\BSS138LT1G.pdf; Author: CERN DEM JLC; CreateDate: 23.03.2009; LatestRevisionDate: 23.03.2009